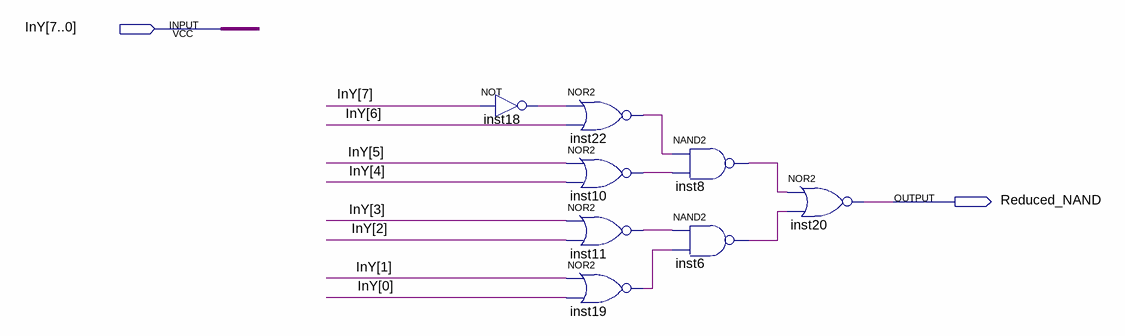
[diagram p0: schematic sheet]
// Quartus schematic NAND8_reducer.bdf as structural Verilog: 8 symbols, 2 pins
module NAND8_reducer (
  input  [7:0] InY,
  output Reduced_NAND
);

  wire inst6_out, inst8_out, inst10_out, inst11_out, inst18_out, inst19_out, inst22_out;

  not inst18 (inst18_out, InY[7]);
  nor inst22 (inst22_out, inst18_out, InY[6]);
  nor inst10 (inst10_out, InY[5], InY[4]);
  nor inst11 (inst11_out, InY[3], InY[2]);
  nor inst19 (inst19_out, InY[1], InY[0]);
  nand inst8 (inst8_out, inst22_out, inst10_out);
  nand inst6 (inst6_out, inst11_out, inst19_out);
  nor inst20 (Reduced_NAND, inst8_out, inst6_out);
endmodule
